# Altium schematic sheet Sheet1.SchDoc
size A4
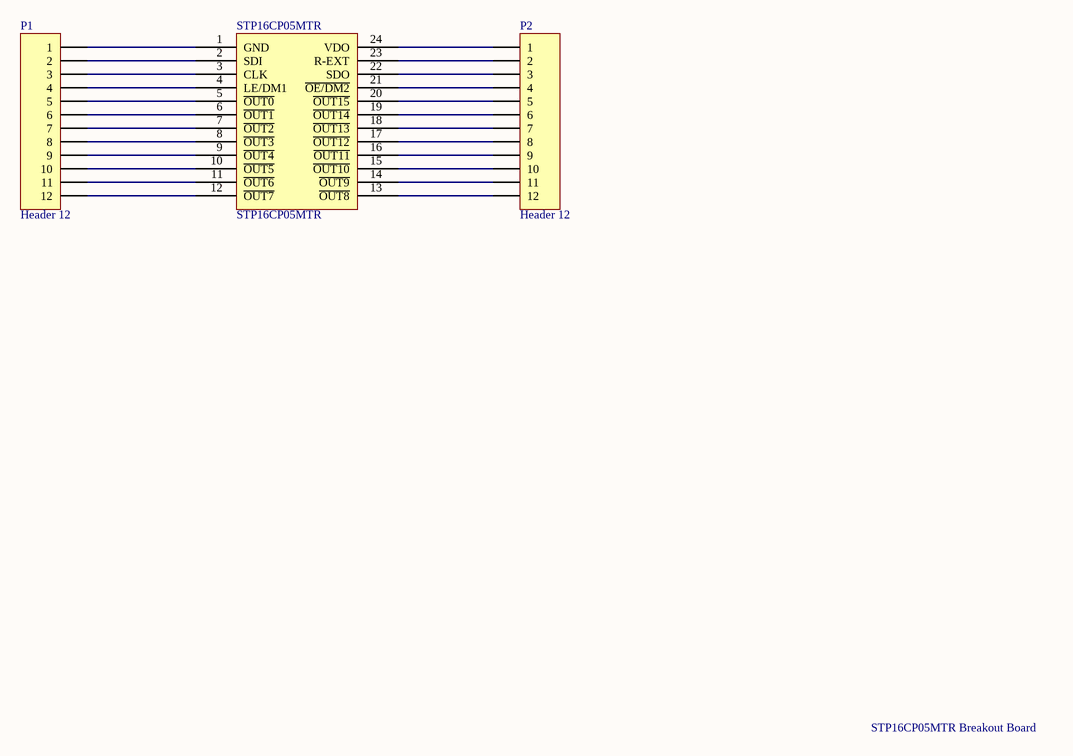
[diagram p0: Sheet1.SchDoc]

## Parts
P1  Header 12  [HDR1X12]
P2  Header 12  [HDR1X12]
STP16CP05MTR  STP16CP05MTR  [STP16CP05MTR-24N]

## Nets
NetP1_1: P1.1 STP16CP05MTR.1(GND)
NetP1_2: P1.2 STP16CP05MTR.2(SDI)
NetP1_3: P1.3 STP16CP05MTR.3(CLK)
NetP1_4: P1.4 STP16CP05MTR.4(LE/DM1)
NetP1_5: P1.5 STP16CP05MTR.5(~{OUT0})
NetP1_6: P1.6 STP16CP05MTR.6(~{OUT1})
NetP1_7: P1.7 STP16CP05MTR.7(~{OUT2})
NetP1_8: P1.8 STP16CP05MTR.8(~{OUT3})
NetP1_9: P1.9 STP16CP05MTR.9(~{OUT4})
NetP1_10: P1.10 STP16CP05MTR.10(~{OUT5})
NetP1_11: P1.11 STP16CP05MTR.11(~{OUT6})
NetP1_12: P1.12 STP16CP05MTR.12(~{OUT7})
NetP2_1: P2.1 STP16CP05MTR.24(VDO)
NetP2_2: P2.2 STP16CP05MTR.23(R-EXT)
NetP2_3: P2.3 STP16CP05MTR.22(SDO)
NetP2_4: P2.4 STP16CP05MTR.21(~{OE/DM2})
NetP2_5: P2.5 STP16CP05MTR.20(~{OUT15})
NetP2_6: P2.6 STP16CP05MTR.19(~{OUT14})
NetP2_7: P2.7 STP16CP05MTR.18(~{OUT13})
NetP2_8: P2.8 STP16CP05MTR.17(~{OUT12})
NetP2_9: P2.9 STP16CP05MTR.16(~{OUT11})
NetP2_10: P2.10 STP16CP05MTR.15(~{OUT10})
NetP2_11: P2.11 STP16CP05MTR.14(~{OUT9})
NetP2_12: P2.12 STP16CP05MTR.13(~{OUT8})

## Notes on the sheet
- STP16CP05MTR Breakout Board

## Library data of the parts
P1 P2 = Header 12: Header, 12-Pin; LatestRevisionDate: 17-Jul-2002; LatestRevisionNote: Re-released for DXP Platform.; Publisher: Altium Limited